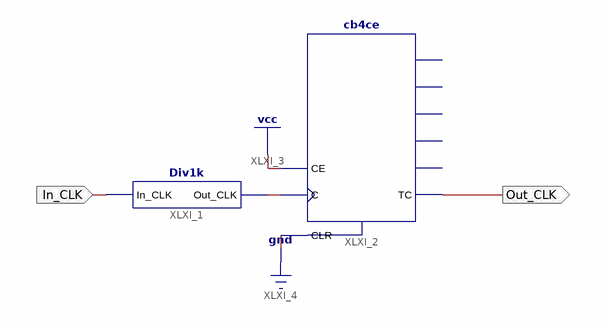
[diagram p0: schematic sheet 1]
// Xilinx ISE schematic Div16K.sch (spartan6) as structural Verilog: 2 symbols, 2 ports
module Div16K (
  input  In_CLK,
  output Out_CLK
);

  wire XLXN_1;

  Div1k XLXI_1 (.In_CLK(In_CLK), .Out_CLK(XLXN_1));
  cb4ce XLXI_2 (.C(XLXN_1), .CE(1'b1), .CLR(1'b0), .TC(Out_CLK));  // open: CEO, Q0, Q1, Q2, Q3
endmodule
